# Altium schematic sheet Power_N2V5.SchDoc
size A4; CompanyName: WEITI ISE; Address1: ul. Nowowiejska 15/19; Address2: 00-665 Warszawa; DocumentNumber: 6; SheetNumber: 6; SheetTotal: 7
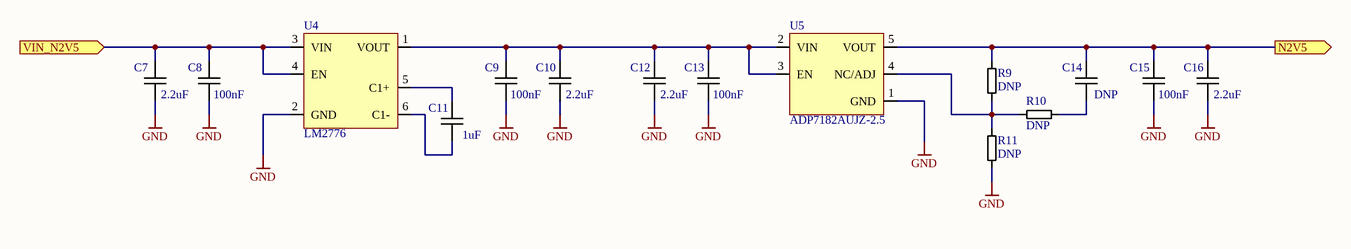
[diagram p0: Power_N2V5.SchDoc]

## Parts
C7  2.2uF  [CAPC0603X90N]
C8  100nF  [CAPC0603X90N]
C9  100nF  [CAPC0603X90N]
C10  2.2uF  [CAPC0603X90N]
C11  1uF  [CAPC0603X90N]
C12  2.2uF  [CAPC0603X90N]
C13  100nF  [CAPC0603X90N]
C14  DNP  [CAPC0603X90N]
C15  100nF  [CAPC0603X90N]
C16  2.2uF  [CAPC0603X90N]
R9  DNP  [RESC0402X40N]
R10  DNP  [RESC0402X40N]
R11  DNP  [RESC0402X40N]
U4  LM2776
U5  ADP7182AUJZ-2.5

## Ports
N2V5 (out), VIN_N2V5 (in)

## Nets
GND: C7.2 C8.2 C9.2 C10.2 C12.2 C13.2 C15.2 C16.2 R11.1 U4.2(GND) U5.1(GND)
N2V5: C14.1 C15.1 C16.1 R9.2 U5.5(VOUT) ; port N2V5
VIN_N2V5: C7.1 C8.1 U4.3(VIN) U4.4(EN) ; port VIN_N2V5
NetC9_1: C9.1 C10.1 C12.1 C13.1 U4.1(VOUT) U5.2(VIN) U5.3(EN)
NetC11_1: C11.1 U4.5(C1+)
NetC11_2: C11.2 U4.6(C1-)
NetC14_2: C14.2 R10.1
NetR9_1: R9.1 R10.2 R11.2 U5.4(NC/ADJ)

## Notes on the sheet
- Project:
- Title
- File:
- Drawn by:
- Engineer:
- Checked by:
- Szymon Jedliński
- Sheet:
- Revision:
- Total Sheet:
- 1.0
- Variant:
- Approved by:
- Date:

## Library data of the parts
C7 C10 C12 C16 = CC0603_2U2F_16V_10%_X7R: Non-polarised capacitor; Manufacturer Part Number: GRM188Z71C225KE43D; DesignItemId: CC0603_2U2F_16V_10%_X7R; HelpURL: https://www.mouser.pl/datasheet/2/281/1/GRM188Z71C225KE43_01A-1985990.pdf; Height: 0.8mm; SMD: Yes; Value: 2.2uF
C8 C9 C13 C15 = CC0603_100NF_16V_10%_X7R: Non-polarised capacitor; Manufacturer Part Number: VJ0603Y104KXJCW1BC; DesignItemId: CC0603_100NF_16V_10%_X7R; HelpURL: https://www.vishay.com/docs/28548/vjw1bcbascomseries.pdf; Height: 0.8mm; SMD: Yes; Value: 100nF
C11 = CC0603_1UF_16V_10%_X7R: Non-polarised capacitor; Manufacturer Part Number: CL10B105KO8NNNC; DesignItemId: CC0603_1UF_16V_10%_X7R; HelpURL: https://www.mouser.pl/datasheet/2/585/MLCC-1837944.pdf; Height: 0.8mm; SMD: Yes; Value: 1uF
C14 = CC0603_DNP: Non-polarised capacitor; Manufacturer Part Number: UNDEFINED; DesignItemId: CC0603_DNP; Height: 0.8mm; SMD: Yes; Value: DNP
R9-R11 = R0402_DNP: General Purpose Thick Film Chip Resistor; Manufacturer 1 Component Height: 0.4mm; Voltage: 50V; DesignItemId: R0402_DNP; HelpURL: https://www.vishay.com/docs/20035/dcrcwe3.pdf; SMD: Yes; Value: DNP
U4 = LM2776: Switched Capacitor Inverter, Input Voltage: 2.7 V to 5.5 V, 200-mA Output Current; Manufacturer Part Number: LM2776DBV(_); Manufacturer 1 Component Height: 1.45mm; DesignItemId: LM2776; Device: LM2776; HelpURL: https://www.ti.com/lit/ds/symlink/lm2776.pdf; SMD: Yes
U5 = ADP7182AUJZ-2.5: LDO Voltage Regulators -30V, 200mA, low noise, Linear Reg, 2.5V; Manufacturer 1 Component Height: 1mm; DesignItemId: ADP7182AUJZ-2.5; Device: ADP7182AUJZ-2.5; HelpURL: https://www.mouser.pl/datasheet/2/609/ADP7182-3122091.pdf; Manufacturer Part Number: ADP7182AUJZ-2.5; SMD: Yes